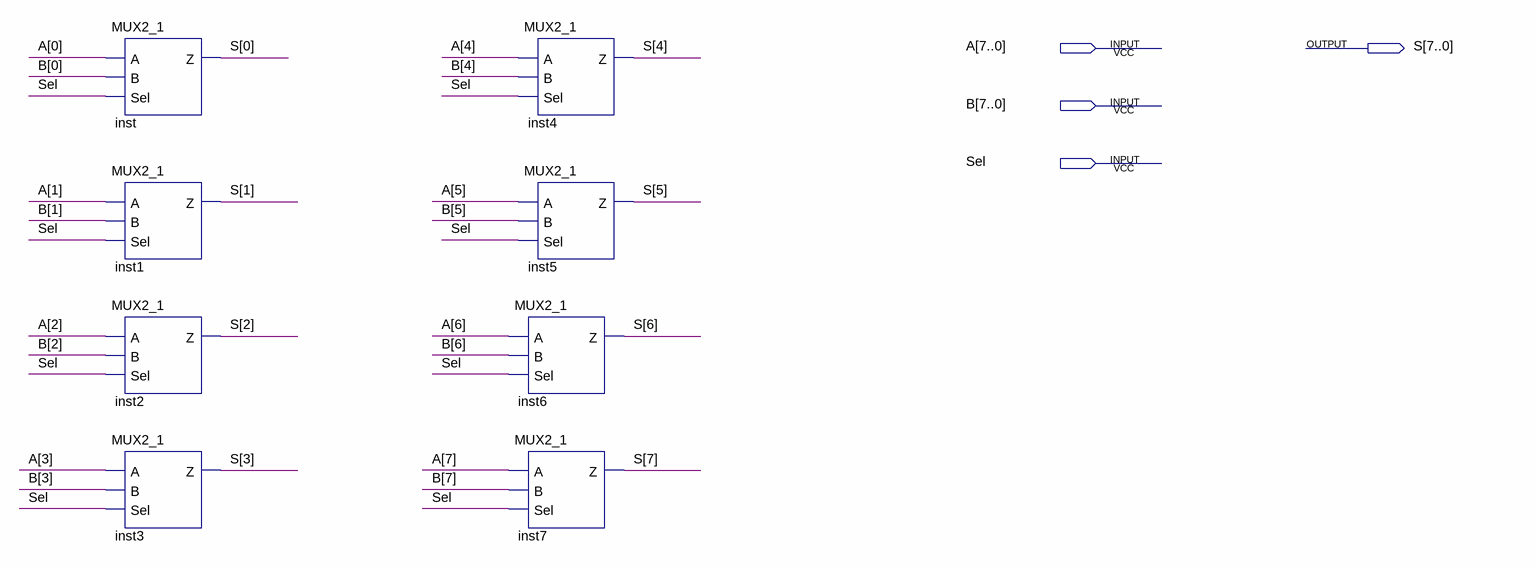
[diagram p0: schematic sheet]
// Quartus schematic MUX.bdf as structural Verilog: 8 symbols, 4 pins
module MUX (
  input  [7:0] A,
  input  [7:0] B,
  input  Sel,
  output [7:0] S
);

  MUX2_1 inst (.A(A[0]), .B(B[0]), .Sel(Sel), .Z(S[0]));
  MUX2_1 inst1 (.A(A[1]), .B(B[1]), .Sel(Sel), .Z(S[1]));
  MUX2_1 inst2 (.A(A[2]), .B(B[2]), .Sel(Sel), .Z(S[2]));
  MUX2_1 inst3 (.A(A[3]), .B(B[3]), .Sel(Sel), .Z(S[3]));
  MUX2_1 inst4 (.A(A[4]), .B(B[4]), .Sel(Sel), .Z(S[4]));
  MUX2_1 inst5 (.A(A[5]), .B(B[5]), .Sel(Sel), .Z(S[5]));
  MUX2_1 inst6 (.A(A[6]), .B(B[6]), .Sel(Sel), .Z(S[6]));
  MUX2_1 inst7 (.A(A[7]), .B(B[7]), .Sel(Sel), .Z(S[7]));
endmodule
